# Altium schematic sheet PWM分图.SchDoc
size A4
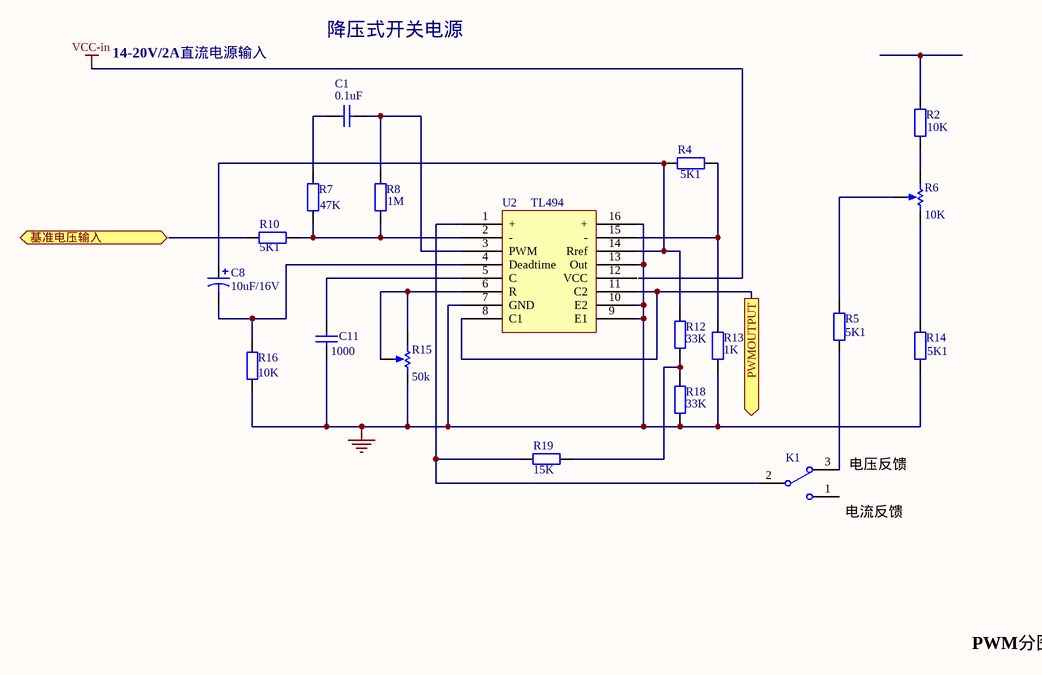
[diagram p0: PWM分图.SchDoc]

## Parts
C1  value 0.1uF  [Cap]  (hidden comment: Cap)
C8  value 10uF/16V  [RB7.6-15]  (hidden comment: Cap Pol1)
C11  value 1000  [Cap]  (hidden comment: Cap)
K1  SW-SPDT  [TL36WW15050]  (value not drawn)
R2  value 10K  [AXIAL-0.4]  (hidden comment: Res2)
R4  value 5K1  [AXIAL-0.4]  (hidden comment: Res2)
R5  value 5K1  [AXIAL-0.4]  (hidden comment: Res2)
R6  value 10K  [VR5]  (hidden comment: RPot)
R7  value 47K  [AXIAL-0.4]  (hidden comment: Res2)
R8  value 1M  [AXIAL-0.4]  (hidden comment: Res2)
R10  value 5K1  [AXIAL-0.4]  (hidden comment: Res2)
R12  value 33K  [AXIAL-0.4]  (hidden comment: Res2)
R13  value 1K  [AXIAL-0.4]  (hidden comment: Res2)
R14  value 5K1  [AXIAL-0.4]  (hidden comment: Res2)
R15  value 50k  [VR5]  (hidden comment: RPot)
R16  value 10K  [AXIAL-0.4]  (hidden comment: Res2)
R18  value 33K  [AXIAL-0.4]  (hidden comment: Res2)
R19  value 15K  [AXIAL-0.4]  (hidden comment: Res2)
U2  TL494  [DIP16]

## Ports
PWMOUTPUT (out), 基准电压输入 (in)

## Nets
GND: C11.1 R13.1 R14.1 R15.2(BOT) R16.1 R18.1 U2.7(GND) U2.9(E1) U2.10(E2) U2.13(Out) U2.16(+)
PWMOUTPUT: U2.8(C1) U2.11(C2) ; port PWMOUTPUT
NetC1_1: C1.1 R8.2 U2.3(PWM)
NetC1_2: C1.2 R7.2
NetC8_1: C8.1 R4.1 R12.2 U2.14(Rref)
NetC8_2: C8.2 R16.2 U2.4(Deadtime)
NetC11_2: C11.2 U2.5(C)
NetK1_2: K1.2 R19.2 U2.1(+)
NetK1_3: K1.3 R5.1
NetR2_1: R2.1 R6.1(TOP)
NetR4_2: R4.2 R13.2 U2.15(-)
NetR5_2: R5.2 R6.3(TAP)
NetR6_2: R6.2(BOT) R14.2
NetR7_1: R7.1 R8.1 R10.2 U2.2(-)
NetR12_1: R12.1 R18.2 R19.1
NetR15_1: R15.1(TOP) R15.3(TAP) U2.6(R)

Not connected (* = marked no-connect by the designer): K1 1; R2 2; R10 1; U2 12(VCC)

## Notes on the sheet
- 降压式开关电源
- 14-20V/2A直流电源输入
- (near K1) 电流反馈
- (near K1) 电压反馈
- PWM分图

## Library data of the parts
C1 C11 = Cap: Capacitor; Published: 8-Jun-2000; LatestRevisionDate: 17-Jul-2002; LatestRevisionNote: Re-released for DXP Platform.; PackageReference: RAD-0.3; Publisher: Altium Limited; PackageDescription: Radial Cap, Thru-Hole; 2 Leads; 0.3 in Pin Spacing
C8 = Cap Pol1: Polarized Capacitor (Radial); Published: 8-Jun-2000; LatestRevisionDate: 17-Jul-2002; LatestRevisionNote: Re-released for DXP Platform.; PackageReference: RB7.6-15; Publisher: Altium Limited; PackageDescription: Polarized Capacitor (Radial); 2 Leads
K1 = SW-SPDT: SPDT Subminiature Toggle Switch, Right Angle Mounting, Vertical Actuation; Published: 24-Mar-1999; LatestRevisionDate: 17-Dec-2003; LatestRevisionNote: Schematic revised, PCB Footprint replaced.; DatasheetDocument: 05-Dec-2000; PackageReference: TL36WW15050; Publisher: Altium Limited; ComponentLink1Description: Manufacturer Link; ComponentLink1URL: http://www.apem.com
R2 R4 R5 R7 R8 R10 R12-R14 R16 R18 R19 = Res2: Resistor; Published: 8-Jun-2000; LatestRevisionDate: 17-Jul-2002; LatestRevisionNote: Re-released for DXP Platform.; PackageReference: AXIAL-0.4; Publisher: Altium Limited; PackageDescription: Axial Device, Thru-Hole; 2 Leads; 0.4 in Pin Spacing
R6 R15 = RPot: Potentiometer; Sim Note: Enter the Resistance value and the set point into parameter fields.; Set Position: 0.5; Published: 8-Jun-2000; LatestRevisionDate: 17-Jul-2002; LatestRevisionNote: Re-released for DXP Platform.; PackageReference: VR5; Publisher: Altium Limited; PackageDescription: Variable Resistor, Thru-Hole; 3 Leads